# EAGLE schematic grbl_shield_hector (EAGLE 8.7.1)
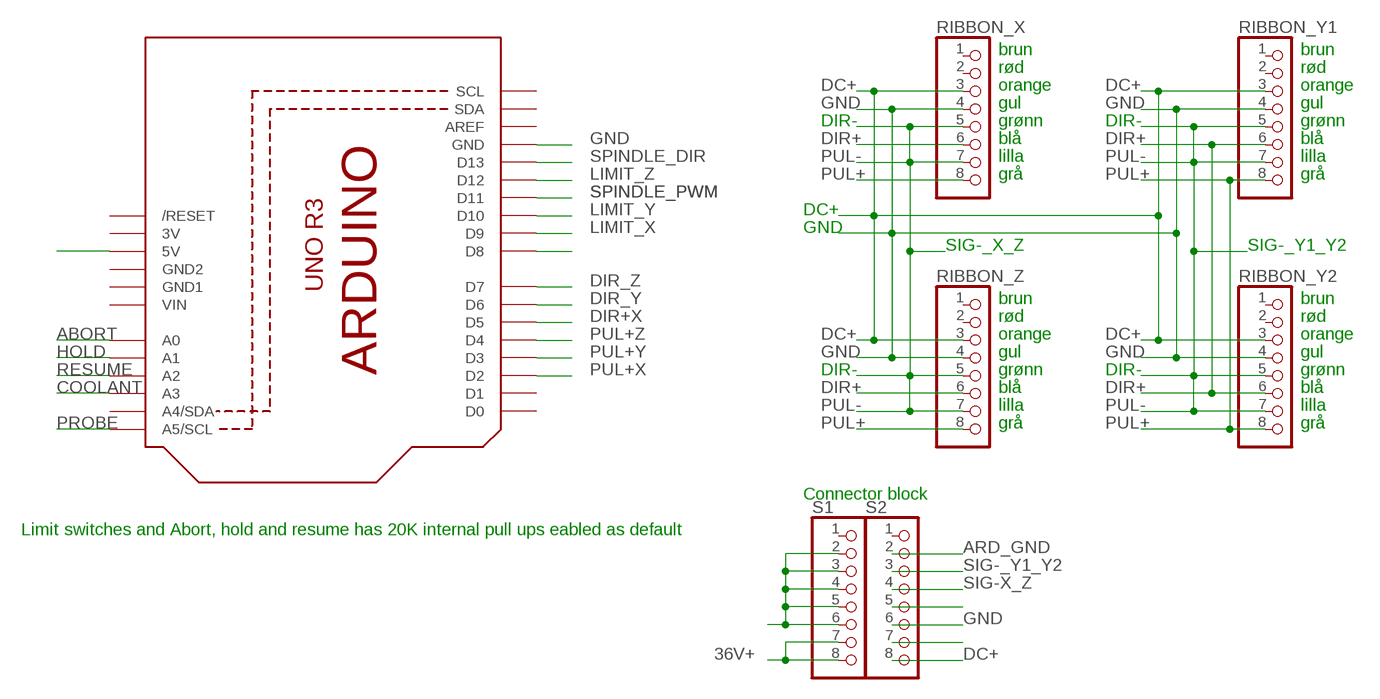
[diagram p0: schematic, sheet 1]

## Parts
Q1  ARDUINOR3-NOIOREF-NOTEXT  [ARDUINOR3-NOTEXT-NOIOREF]
RIBBON_X  PINHD-1X8  [1X08]
RIBBON_Y1  PINHD-1X8  [1X08]
RIBBON_Y2  PINHD-1X8  [1X08]
RIBBON_Z  PINHD-1X8  [1X08]
S1  PINHD-1X8  [1X08]
S2  PINHD-1X8  [1X08]

## Nets
36V+: S1.7 S1.8
36V_GND: S1.2 S1.3 S1.4 S1.5 S1.6
ABORT: Q1.A0
ARD_GND: S2.2
COOLANT: Q1.A3
DC+: RIBBON_X.3 RIBBON_Y1.3 RIBBON_Y2.3 RIBBON_Z.3 S2.8
DIR+: RIBBON_X.6 RIBBON_Y1.6 RIBBON_Y2.6 RIBBON_Z.6
DIR+X: Q1.D5
DIR_Y: Q1.D6
DIR_Z: Q1.D7
GND: Q1.GND RIBBON_X.4 RIBBON_Y1.4 RIBBON_Y2.4 RIBBON_Z.4 S2.6
HOLD: Q1.A1
LIMIT_X: Q1.D9
LIMIT_Y: Q1.D10
LIMIT_Z: Q1.D12
PROBE: Q1.A5(A5/SCL)
PUL+: RIBBON_X.8 RIBBON_Y1.8 RIBBON_Y2.8 RIBBON_Z.8
PUL+X: Q1.D2
PUL+Y: Q1.D3
PUL+Z: Q1.D4
PUL-: RIBBON_X.5 RIBBON_X.7 RIBBON_Y1.5 RIBBON_Y1.7 RIBBON_Y2.5 RIBBON_Y2.7 RIBBON_Z.5 RIBBON_Z.7
RESUME: Q1.A2
SENS+: S2.7
SENS-: S2.5
SIG-_Y1_Y2: S2.3
SIG-X_Z: S2.4
SPINDLE_DIR: Q1.D13
SPINDLE_PWM: Q1.D11
STEPPER_ENABLE: Q1.D8
VCC_SIGNAL: Q1.5V
Unconnected: Q1.A4(A4/SDA) Q1.AREF Q1.D0 Q1.D1 Q1.RESET(/RESET) Q1.SCL Q1.SDA RIBBON_X.1 RIBBON_X.2 RIBBON_Y1.1 RIBBON_Y1.2 RIBBON_Y2.1 RIBBON_Y2.2 RIBBON_Z.1 RIBBON_Z.2 S1.1 S2.1

## Notes on the sheet
- brun | brun
- rød | rød
- orange | orange
- gul | gul
- DIR- | grønn | DIR- | grønn
- blå | blå
- lilla | lilla
- grå | grå
- DC+
- GND
- SIG-_X_Z | SIG-_Y1_Y2
- brun | brun
- rød | rød
- orange | orange
- gul | gul
- DIR- | grønn | DIR- | grønn
- blå | blå
- lilla | lilla
- grå | grå
- Connector block
- Limit switches and Abort, hold and resume has 20K internal pull ups eabled as default

## Power pins joined to a net without a drawn wire
3V: Q1.3V
GND1: Q1.GND1
GND2: Q1.GND2
VIN: Q1.VIN

## Library data of the parts
Q1 = adafruit:ARDUINOR3-NOIOREF
RIBBON_X RIBBON_Y1 RIBBON_Y2 RIBBON_Z S1 S2 = pinhead:PINHD-1X8: PIN HEADER